# Altium schematic sheet Sheet1.SchDoc
size 558 x 431 mm; SheetNumber: 1; SheetTotal: 1
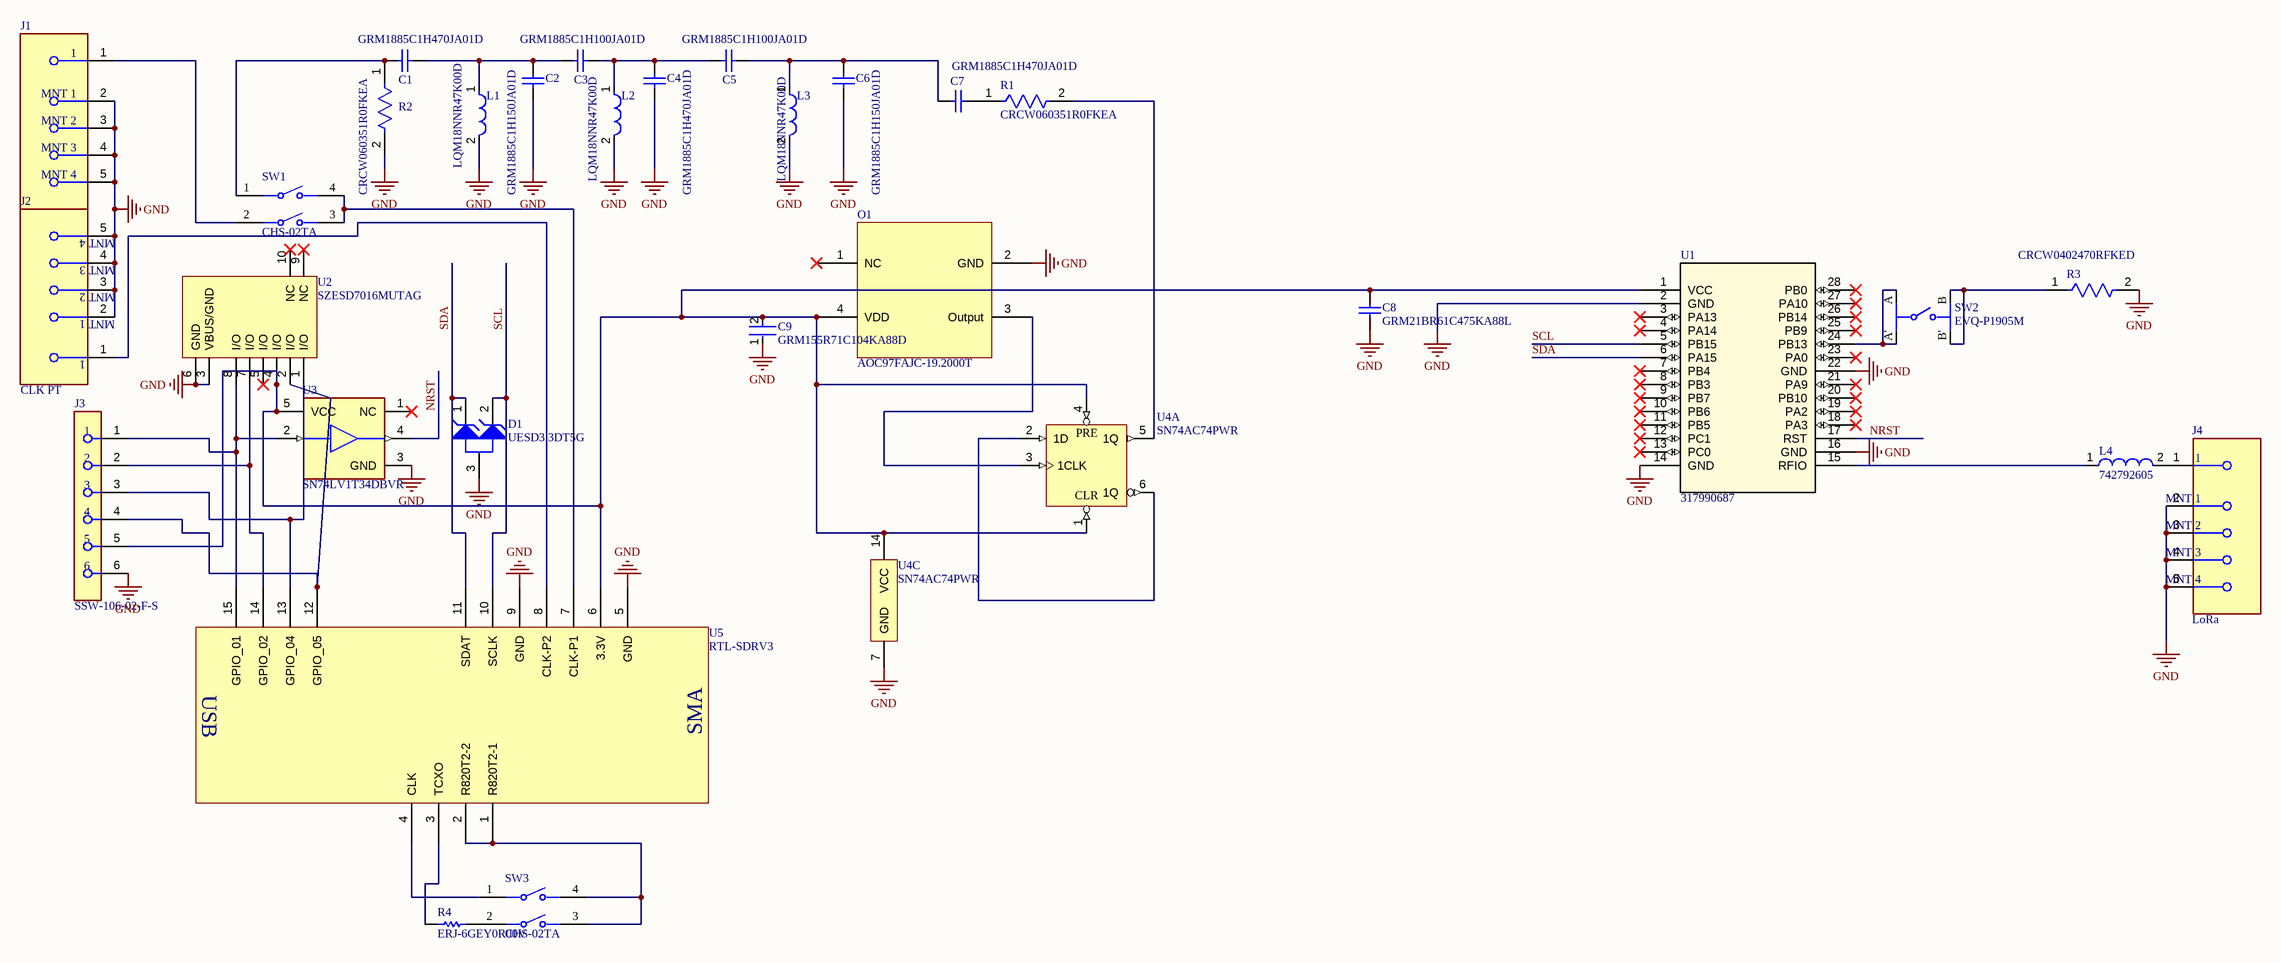
[diagram p0: Sheet1.SchDoc]

## Parts
C1  GRM1885C1H470JA01D  [CAPC1608X90X35ML10T15]
C2  GRM1885C1H150JA01D  [CAPC1608X90X35ML10T15]
C3  GRM1885C1H100JA01D  [CAPC1608X90X35LL10T15]
C4  GRM1885C1H470JA01D  [CAPC1608X90X35ML10T15]
C5  GRM1885C1H100JA01D  [CAPC1608X90X35LL10T15]
C6  GRM1885C1H150JA01D  [CAPC1608X90X35ML10T15]
C7  GRM1885C1H470JA01D  [CAPC1608X90X35ML10T15]
C8  GRM21BR61C475KA88L  [CAPC2013X135X45LL10T25]
C9  GRM155R71C104KA88D  [FP-GRM15-MFG]
D1  UESD3.3DT5G  [ONSC-SOT-723-3-631AA-01_V]
J1  CLK IO  [FP-73391-0083-MFG]
J2  CLK PT  [FP-73391-0083-MFG]
J3  SSW-106-02-F-S  [FP-SSW-106-02-F-S-MFG]
J4  LoRa  [FP-73391-0083-MFG]
L1  LQM18NNR47K00D  [FP-LQM18NN_00-IPC_A]
L2  LQM18NNR47K00D  [FP-LQM18NN_00-IPC_A]
L3  LQM18NNR47K00D  [FP-LQM18NN_00-IPC_A]
L4  742792605  [SMD-0603]
O1  AOC97FAJC-19.2000T  [AOC97FAJC-19.2000T]
R1  CRCW060351R0FKEA  [FP-CRCW0603-e3-MFG]
R2  CRCW060351R0FKEA  [FP-CRCW0603-e3-MFG]
R3  CRCW0402470RFKED  [FP-CRCW0402-e3-MFG]
R4  ERJ-6GEY0R00V  [RESC2013X70X40NL20T20]
SW1  CHS-02TA  [FP-CHS-02TA-MFG]
SW2  EVQ-P1905M  [FP-EVQ-P1905M-MFG]
SW3  CHS-02TA  [FP-CHS-02TA-MFG]
U1  317990687  [QFN_90687_SEE]
U2  SZESD7016MUTAG  [ONSC-UDFN-8-517CB_V]
U3  SN74LV1T34DBVR  [FP-DBV0005A-IPC_B]
U4  SN74AC74PWR  [PW0014A_L]  (parts A,C of 3)
U5  RTL-SDRV3  [RTLSDR V3]

## Nets
GND: C2.1 C4.1 C6.1 C8.1 C9.1 D1.3(A) J1.2(MNT_1) J1.3(MNT_2) J1.4(MNT_3) J1.5(MNT_4) J2.2(MNT_1) J2.3(MNT_2) J2.4(MNT_3) J2.5(MNT_4) J3.6 J4.2(MNT_1) J4.3(MNT_2) J4.4(MNT_3) J4.5(MNT_4) L1.2 L2.2 L3.2 O1.2(GND) R2.2 R3.2 U1.2(GND) U1.14(GND) U1.16(GND) U1.22(GND) U2.3(VBUS/GND) U2.6(GND) U3.3(GND) U4.7(GND) U5.5(GND) U5.9(GND)
NRST: U1.17(RST) U3.4(Y)
SCL: D1.2(K2) U1.5(PB15) U5.10(SCLK)
SDA: D1.1(K1) U1.6(PA15) U5.11(SDAT)
NetC1_1: C1.1 C2.2 C3.1 L1.1
NetC1_2: C1.2 R2.1 SW1.1
NetC3_2: C3.2 C4.2 C5.1 L2.1
NetC5_2: C5.2 C6.2 C7.1 L3.1
NetC7_2: C7.2 R1.1
NetC8_2: C8.2 C9.2 J3.5 O1.4(VDD) U1.1(VCC) U2.4(I/O) U3.5(VCC) U4.1(1~{CLR}) U4.4(1~{PRE}) U4.14(VCC) U5.6(3.3V)
NetJ1_1: J1.1 SW1.2
NetJ2_1: J2.1 U5.8(CLK-P2)
NetJ3_1: J3.1 U2.8(I/O) U3.2(A) U5.15(GPIO_01)
NetJ3_2: J3.2 U2.7(I/O) U5.14(GPIO_02)
NetJ3_3: J3.3 U2.1(I/O) U5.13(GPIO_04)
NetJ3_4: J3.4 U2.2(I/O) U5.12(GPIO_05)
NetJ4_1: J4.1 L4.2
NetL4_1: L4.1 U1.15(RFIO)
NetO1_3: O1.3(Output) U4.3(1CLK)
NetR1_2: R1.2 U4.5(1Q)
NetR3_1: R3.1 SW2.B SW2.B'
NetR4_1: R4.1 U5.3(TCXO)
NetR4_2: R4.2 SW3.2
NetSW1_3: SW1.3 SW1.4 U5.7(CLK-P1)
NetSW2_A: SW2.A SW2.A' U1.24(PB13)
NetSW3_1: SW3.1 U5.4(CLK)
NetSW3_3: SW3.3 SW3.4 U5.1(R820T2-1) U5.2(R820T2-2)
NetU4_2: U4.2(1D) U4.6(1Q)

Not connected (* = marked no-connect by the designer): O1 1(NC)*; U1 3(PA13)* 4(PA14)* 7(PB4)* 8(PB3)* 9(PB7)* 10(PB6)* 11(PB5)* 12(PC1)* 13(PC0)* 18(PA3)* 19(PA2)* 20(PB10)* 21(PA9)* 23(PA0)* 25(PB9)* 26(PB14)* 27(PA10)* 28(PB0)*; U2 5(I/O)* 9(NC)* 10(NC)*; U3 1(NC)*

## Notes on the sheet
- DWG. NO.
- REV.
- SHT.
- REVISION
- DESCRIPTION
- DATE
- APPROVED
- THIS DOCUMENT AND THE DATA DISCLOSED HEREIN OR HEREWITH IS THE PROPERTY OF ALTIUM LIMITED AND MAY BE FREELY DISTRIBUTED IN WHOLE. NO RIGHTS ARE RESERVED OR EXPRESS OR IMPLIED WARANTEE GIVEN.
- ENG:
- DSN:
- APPROVALS
- PROJECT
- DOCUMENT REVISION:
- DESIGN ITEM:
- CHK:
- BOM:
- REFERENCE DOCUMENTS
- PROJECT REVISION:
- TITLE
- FAB DWG:
- PCB DWG:
- ASSY DWG:
- SCALE:
- SIZE
- C
- CAGE CODE
- FILE NAME
- DWG NO.
- SHEET
- OF
- REV
- (in symbol CMP-1619-00914-2, part A) PRE; CLR
- (in symbol RTL-SDR) USB; SMA

## Library data of the parts
C1 C4 C7 = CMP-2006-02672-1: Manufacturer: Murata; Part Number: GRM1885C1H470JA01D
C2 C6 = CMP-2006-02610-1: Manufacturer: Murata; Part Number: GRM1885C1H150JA01D
C3 C5 = CMP-2006-02592-1: Manufacturer: Murata; Part Number: GRM1885C1H100JA01D
C8 = CMP-1662-00015-2: Chip Capacitor, 4.7 uF, +/- 10%, 16 V, -55 to 85 degC, 0805 (2012 Metric), RoHS, Tape and Reel; Voltage Rating (DC): 16 V; Capacitance: 4.7 uF; Type (Capacitors): X5R; Case\/Package: 0805; Pins: 2; DatasheetVersion: 03/2016; REACH SVHC: No SVHC; Tolerance: 10%; PartNumber: GRM21BR61C475KA88L; Width: 1.25 mm; Mount: Surface Mount; ComponentLink1Description: Manufacturer URL; Case Code (Metric): 2012; PackageDescription: 2-Pin Surface Mount Device, Body 2 x 1.25 mm; Height: 1.25 mm; Voltage Rating: 16 V; Max Operating Temperature: 85 degC; RoHSCompliant: true; Length: 2 mm; ComponentLink1URL: http://www.murata.com/; Mounting Technology: Surface Mount; Packaging: Tape and Reel; Min Operating Temperature: -55 degC; ComponentLink2Description: Datasheet; Case Code (Imperial): 0805; Radiation Hardening: No; Package Quantity: 3000; PackageReference: 0805; ComponentLink2URL: http://search.murata.co.jp/Ceramy/image/img/A01X/G101/ENG/GRM21BR61C475KA88-01.pdf
C9 = CMP-2100-03641-2: CAP CER 0.1UF 16V X7R 0402; Manufacturer: Murata; Standoff Height: 0mm; Tolerance: 10%; Voltage Rating: 16Vdc; Material: Ceramic; Capacitance: 0.10μF; Value: 0.10μF; RoHS: TRUE; Manufacturer Part Number: GRM155R71C104KA88D; Temperature Characteristic: X7R; Octopart: https://octopart.com/grm155r71c104ka88d-murata-196880; Digikey Description: CAP CER 0.1UF 16V X7R 0402; Device Class L3: Ceramic Capacitors; Height: 0.55mm; ComponentLink2Description: Datasheet; Temperature Range Low: -55°C; Ipc Land Pattern Name: CAPC10050X219; ComponentLink2URL: https://search.murata.co.jp/Ceramy/image/img/A01X/G101/ENG/GRM155R71H471KA01-01A.pdf; Device Class L1: Passive Components; Lead Free: yes; Category: Cap; Package: GRM15; Temperature: -55°C to +125°C; Device Class L2: Capacitors; Temperature Range High: +125°C; Mouser Description: 0402 0.1 uF 16V ±10 % Tolerance X7R SMT Multilayer Ceramic Capacitor
D1 = CMP-1063-00209-1: ESD Protection Diode, 3-Pin SOT-723, Pb-Free, Tape and Reel; Manufacturer: On Semiconductor; IR Max (uA): 1; V(BR) Min (V): 5; Direction: Unidirectional; Number of Lines: 2; VRWM Max (V): 3.3; ComponentLink2Description: Datasheet; ComponentLink2URL: http://www.onsemi.cn/pub_link/Collateral/UESD3.3DT5G-D.PDF; ComponentLink1URL: http://www.onsemi.com/; Packing: Tape and Reel; PackageDescription: 3-Pin Small Outline Transistor, Body 1.2 x 0.8 mm, Pitch 0.4 mm; PartNumber: UESD3.3DT5G; ComponentLink3URL: http://www.onsemi.com/pub_link/Collateral/631AA.PDF; ComponentLink3Description: Package Specification; Mounting Technology: Surface Mount; DatasheetVersion: Rev. 4; PackageReference: SOT-723-3-631AA-01; ComponentLink1Description: Manufacturer URL; PackageVersion: Rev. D, 08/2009; RoHS: Pb-Free
J1 J2 J4 = CMP-04764-000017-1: SMA RA JACK, PCB; Impedance: 50R; Body Plating: Gold; Gender: Female; REACH SVHC: No SVHC; Mount: PCB; Contact Plating: Gold; Contact Material: Copper; Case/Package: SMA; Connector Type: SMA; Orientation: Right Angle; Termination: Solder; RoHS Compliant: Yes
J3 = CMP-1023-00361-2: CONN RCPT 6POS 0.1 GOLD PCB; Contact Resistance: 10mR; Pitch: 2.54mm; Gender: Female; Max Voltage Rating (AC): 550V; Number of Contacts: 6; Max Current Rating: 6.9A; Mating Cycles: 100; Number of Rows: 1; Length: 15.75mm; Depth: 2.41mm; Termination: Solder; Packaging: Bulk; RoHS Compliant: Yes; Housing Material: Polymer; Min Operating Temperature: -55°C; Orientation: Vertical; Contact Material: Bronze; Color: Black; Radiation Hardening: No; Contact Plating: Gold; Housing Color: Black; Max Operating Temperature: 125°C
L1-L3 = CMP-06042-017008-1: Multilayer Type Inductor for General Circuits, 0603 (1608), 470nH, 10%, 1.35Ω, 35mA; Test Frequency: 25MHz; Core Material: Ferrite; DC Resistance (DCR): 1.35R; Self Resonant Frequency: 105MHz; Shielding: Shielded; Q Factor: 15; Package Quantity: 4000; Termination: SMD/SMT; Military Standard: Not; Inductance Tolerance: 10%; DC Current: 35mA; Inductance: 470nH; Max DC Current: 35mA; Length: 1.6mm; Min Operating Temperature: -40°C; Height - Seated (Max): 0.035inch; REACH SVHC: No SVHC; Case/Package: 0603; Case Code (Imperial): 0603; Radiation Hardening: No; Depth: 0.95mm; Current Rating: 35mA; Lead Free: Lead Free; Mount: Surface Mount; Height: 0.8mm; Packaging: Tape and Reel; Width: 0.031inch; Tolerance: 10%; Series: LQM18N; Max Operating Temperature: 85°C; Case Code (Metric): 1608
L4 = CMP-0220-00183-1: SMD EMI Suppression Ferrite Bead WE-CBF, Z = 33 Ohm; Impedance: 15 Ohm; PackageReference: SMD-0603; ComponentLink1URL: http://www.we-online.com; ComponentLink2URL: http://www.we-online.de/katalog/media/pdf/742792605.pdf; ComponentLink1Description: Manufacturer Link; DatasheetVersion: Dec-2005; PackageDescription: Chip Inductor, 2-Leads, Body 1.6 x 0.8 mm; ComponentLink2Description: Datasheet; PackageVersion: 2009
R1 R2 = CMP-2000-03446-2: RES Thick Film, 51Ω, 1%, 0.1W, 100ppm/°C, 0603; Power Rating: 100mW; Voltage Rating: 75V; Resistance: 51R; Military Standard: Not; Case Code (Imperial): 0603; Max Operating Temperature: 155°C; Temperature Coefficient: 100ppm/°C; Lead Free: Lead Free; Weight: 7.1E-05oz; Number of Pins: 2; Package Quantity: 10; Case/Package: 0603; Termination: SMD/SMT; Min Operating Temperature: -55°C; Tolerance: 1%; Contact Plating: Tin; Height: 0.45mm; Working Voltage: 75V; Radiation Hardening: No; Packaging: Tape and Reel; Composition: Thick Film; Max Power Dissipation: 100mW; Width: 0.85mm; Depth: 0.85mm; Length: 1.55mm; Case Code (Metric): 1608; Voltage Rating (DC): 75V; Number of Terminations: 2; Features: Automotive AEC-Q200
R3 = CMP-2002-00022-2: RES Thick Film, 470Ω, 1%, 0.063W, 100ppm/°C, 0402; Power Rating: 63mW; Voltage Rating (DC): 50V; Resistance: 470R; Case Code (Imperial): 0402; Tolerance: 1%; Lead Free: Lead Free; Max Operating Temperature: 155°C; Military Standard: Not; Height: 0.35mm; Termination: SMD/SMT; Mount: Surface Mount; Features: Automotive AEC-Q200; Composition: Thick Film; Temperature Coefficient: 100ppm/°C; Case Code (Metric): 1005; Package Quantity: 10; Radiation Hardening: No; Max Power Dissipation: 63mW; Weight: 2.3E-05oz; Width: 0.5mm; Length: 1mm; Depth: 0.5mm; Min Operating Temperature: -55°C; Voltage Rating: 50V; Case/Package: 0402; Packaging: Tape and Reel; Contact Plating: Tin; Number of Terminations: 2
R4 = CMP-1665-00002-5: Chip Resistor, 0 Ohm, +/- 1%, 0.125 W, -55 to 155 degC, 0805 (2012 Metric), RoHS, Tape and Reel; Tolerance: 5%; Resistance: 0 Ohm; REACH SVHC: No SVHC; Min Operating Temperature: -55 degC; Case/Package: 0805; Packaging: Tape and Reel; Package Quantity: 5000; ComponentLink1Description: Manufacturer URL; PackageDescription: 2-Pin Surface Mount Device, Body 2 x 1.25 mm; Mounting Technology: Surface Mount; Max Operating Temperature: 155 degC; PartNumber: ERJ-6GEY0R00V; Width: 1.25 mm; RoHSCompliant: True; Height: 0.6 mm; ComponentLink1URL: http://www.panasonic.com/; ComponentLink2URL: http://industrial.panasonic.com/cdbs/www-data/pdf/RDA0000/AOA0000C84.pdf; Case Code (Imperial): 0805; DatasheetVersion: 03/2015; Length: 2 mm; Case Code (Metric): 2012; ComponentLink2Description: Datasheet; Radiation Hardening: No
SW1 SW3 = CMP-71745-000006-1: SWITCH SLIDE DIP SPST 100MA 6V; Washable: Yes; Max Voltage Rating (DC): 24V; Pitch: 0.05inch; Actuator Type: Slide (Standard); Number of Positions: 2; Body Material: Polyphenylene; Electrical Life: 2000Cycles; Orientation: Vertical; Packaging: Tape and Reel; RoHS Compliant: Yes; Termination: J-Hook; Voltage Rating (DC): 6V; Contact Plating: Gold; Lead Free: Lead Free; Min Operating Temperature: -40°C; Contact Material: Copper Alloy; Max Operating Temperature: 85°C; Length: 0.161inch; Mount: Surface Mount; Series: CHS; Current Rating: 100mA; Throw Configuration: SPST
SW2 = CMP-05618-000070-1: SWITCH TACTILE SPST-NO 0.05A 12V; Current Rating: 50mA; Operating Force: 1.6N; Illumination Type: Non-Illuminated; Actuator Length: 1.5mm; Actuator Type: Standard; Electrical Life: 100000Cycles; Contact Resistance: 100mR; Actuator Color: Natural; Throw Configuration: SPST; Switch Travel: 1.3mm; Switch Function: Off-Mom; Mount: Surface Mount; Lead Free: Lead Free; Orientation: Straight; REACH SVHC: No SVHC; Max Voltage Rating (DC): 12V; Packaging: Tape and Reel; Mechanical Life: 100000Cycles; Voltage Rating (DC): 12V; Package Quantity: 2000; Series: EVQP1; Case/Package: SMD/SMT; Max Operating Temperature: 85°C; Size: 6.1mm; Contact Plating: Gold; Termination: J-Bend; Min Operating Temperature: -40°C; Radiation Hardening: No; RoHS Compliant: Yes
U1 = 317990687: No Description Available; Manufacturer_Name: BeagleBoard; Copyright: Copyright (C) 2025 Ultra Librarian. All rights reserved.; Manufacturer_Part_Number: 317990687; RefDes: RefDes; Type: Type
U2 = CMP-1063-00262-1: Low Capacitance ESD Protection USB3.0, 8-Pin UDFN, Pb-Free, Tape and Reel; Manufacturer: On Semiconductor; IR Max (uA): 1; V(BR) Min (V): 5.5; VRWM Max (V): 5; Direction: Bidirectional; Number of Lines: 6; Packing: Tape and Reel; ComponentLink1Description: Manufacturer URL; ComponentLink1URL: http://www.onsemi.com/; PackageDescription: 8-Pin Small Outline No-Lead, Body 3.3 x 1 mm, Pitch 0.4 mm; ComponentLink3URL: http://www.onsemi.com/pub_link/Collateral/517CB.PDF; Mounting Technology: Surface Mount; ComponentLink2Description: Datasheet; PackageReference: UDFN-8-517CB; ComponentLink2URL: http://www.onsemi.com/pub_link/Collateral/ESD7016-D.PDF; PartNumber: SZESD7016MUTAG; DatasheetVersion: Rev. 3; RoHS: Pb-Free; ComponentLink3Description: Package Specification; PackageVersion: Rev. O, 09/2011
U3 = CMP-0859-00123-4: IC BUF NON-INVERT 5.5V SOT23-5; Low Level Output Current: 8mA; Polarity: Non-Inverting; Number of Channels: 1; Propagation Delay: 15.5ns; High Level Output Current: -8mA; Quiescent Current: 1uA; Logic Function: Buffer; Min Supply Voltage: 1.6V; Min Operating Temperature: -40°C; Package Quantity: 3000; Max Operating Temperature: 125°C; Operating Supply Current: 8mA; Radiation Hardening: No; REACH SVHC: No SVHC; Number of Bits per Element: 1; Mount: Surface Mount; Number of Outputs: 1; Lead Free: Lead Free; Number of Pins: 5; Weight: 0.000353oz; Number of Output Lines: 1; Number of Elements: 1; Number of Input Lines: 1; Number of Bits: 1; Case/Package: SOT-23-5; Packaging: Tape and Reel; Max Supply Voltage: 5.5V; Number of Inputs: 1
U4 = CMP-1619-00914-2: Dual Positive-Edge-Triggered D-Type Flip-Flops With Clear and Preset, PW0014A, LARGE T&R; Manufacturer: Texas Instruments; Schmitt Trigger: No; Output: 3S; Voltage(Nom)(V): 3.3,5; Technology Family: AC; VCC(Min)(V): 2; Input Type: CMOS; ICC @ Nom Voltage(Max)(mA): 0.02; Rating: Catalog; tpd @ Nom Voltage(Max)(ns): 13.5,10.5; Output Logic: Inverted,Non-inverted; Output Drive (IOL/IOH)(Max)(mA): 24/-24; F @ Nom Voltage(Max)(Mhz): 100; VCC(Max)(V): 6; Generic Part Number: SN74AC74; 3-State Output: No; PackageReference: PW0014A; DatasheetVersion: SCAS521F; Code_JEDEC: MO-153; Operating Temperature Range(C): -40 to 85; Bits(#): 2; Output Type: CMOS
U5 = RTL-SDR